# Altium schematic sheet IO_v35.SchDoc: AMF CONTROLLER GC12
size A4; Date: NOV 2011; DrawnBy: SURAJ; Engineer: SURAJ K A; Revision: 310; SheetNumber: 2; SheetTotal: 2
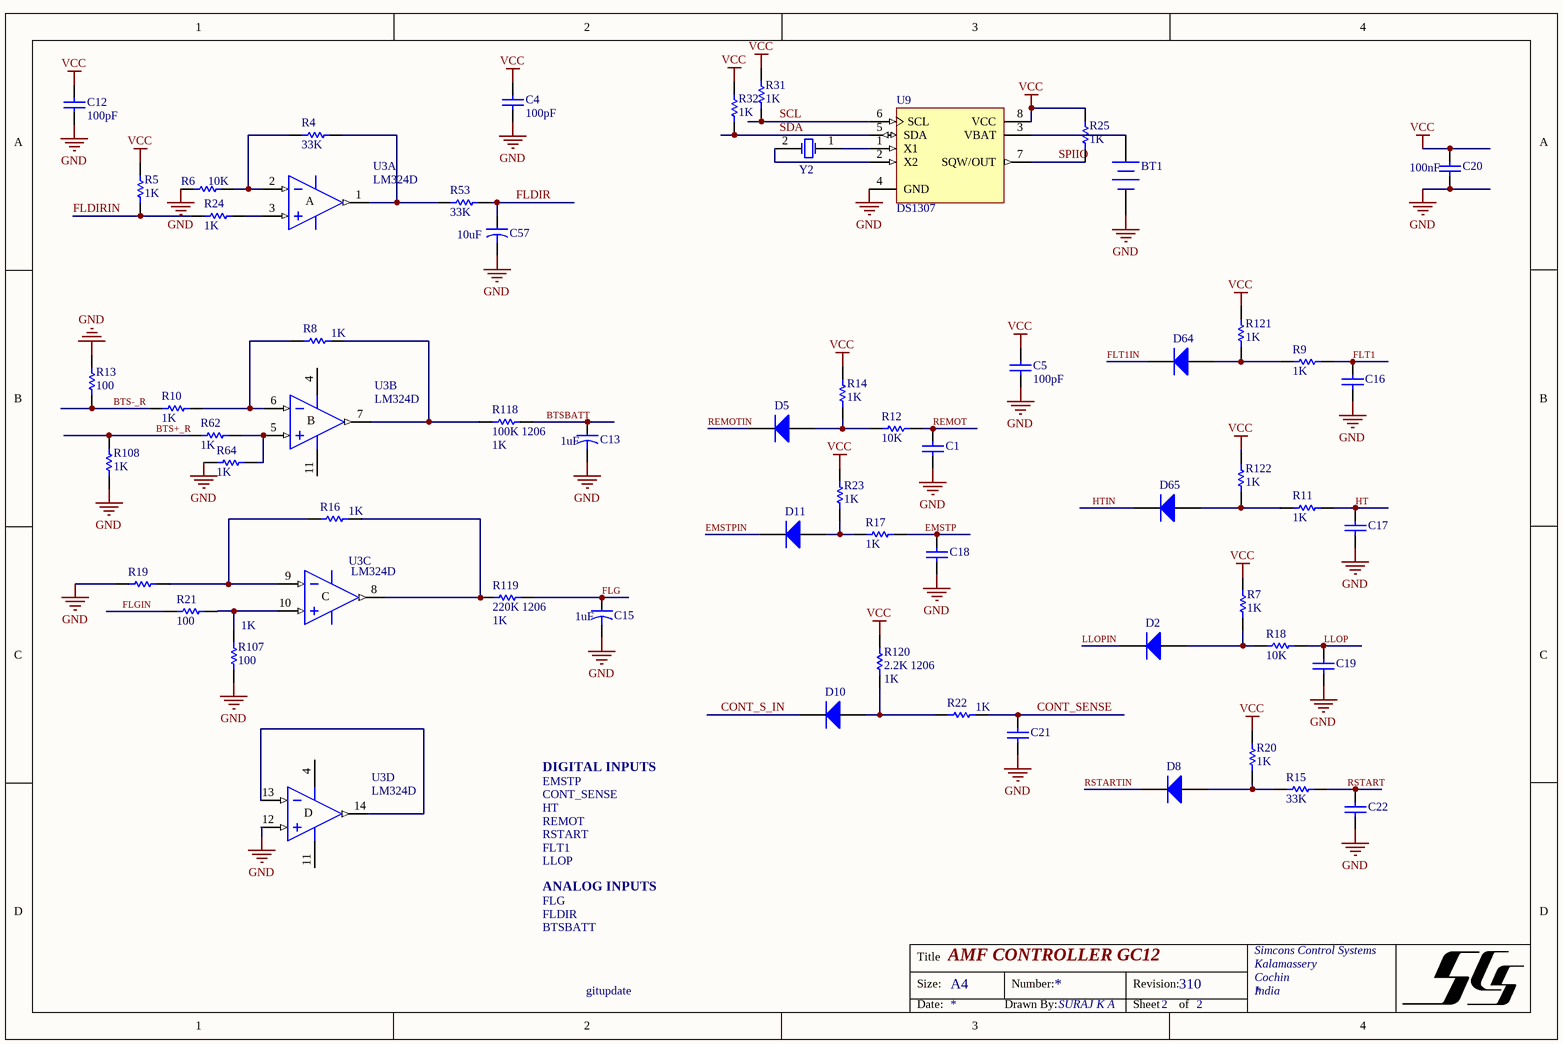
[diagram p0: IO_v35.SchDoc]

## Parts
BT1  CR2032  [CELL_HOLDER]  (value not drawn)
C1  .1uF 1206  [C1206]  (value not drawn)
C4  value 100pF  [C1206]  (hidden comment: .1uF 1206)
C5  value 100pF  [C1206]  (hidden comment: .1uF 1206)
C12  value 100pF  [C1206]  (hidden comment: .1uF 1206)
C13  value 1uF  [C1206]  (hidden comment: 1uF 1206)
C15  value 1uF  [C1206]  (hidden comment: 1uF 1206)
C16  .1uF 1206  [C1206]  (value not drawn)
C17  .1uF 1206  [C1206]  (value not drawn)
C18  .1uF 1206  [C1206]  (value not drawn)
C19  .1uF 1206  [C1206]  (value not drawn)
C20  value 100nF  [C1206]  (hidden comment: .1uF 1206)
C21  .1uF 1206  [C1206]  (value not drawn)
C22  .1uF 1206  [C1206]  (value not drawn)
C57  value 10uF  [C1206]  (hidden comment: 1uF 1206)
D2  1N4148 SMD  [4148SMDW]  (value not drawn)
D5  1N4148 SMD  [4148SMDW]  (value not drawn)
D8  1N4148 SMD  [4148SMDW]  (value not drawn)
D10  1N4148 SMD  [4148SMDW]  (value not drawn)
D11  1N4148 SMD  [4148SMDW]  (value not drawn)
D64  1N4148 SMD  [4148SMDW]  (value not drawn)
D65  1N4148 SMD  [4148SMDW]  (value not drawn)
R4  value 33K  [R1206]  (hidden comment: 220K 1206)
R5  value 1K  [R1206]  (hidden comment: 1K 1206)
R6  value 10K  [R1206]  (hidden comment: 100K 1206)
R7  value 1K  [R1206]  (hidden comment: 2.2K 1206)
R8  value 1K  [R1206]  (hidden comment: 1M 1206)
R9  value 1K  [R1206]  (hidden comment: 100K 1206)
R10  value 1K  [R1206]  (hidden comment: 1M 1206)
R11  value 1K  [R1206]  (hidden comment: 100K 1206)
R12  value 10K  [R1206]  (hidden comment: 100K 1206)
R13  value 100  [R1206]  (hidden comment: 47K 1206)
R14  value 1K  [R1206]  (hidden comment: 2.2K 1206)
R15  value 33K  [R1206]  (hidden comment: 100K 1206)
R16  value 1K  [R1206]  (hidden comment: 220K 1206)
R17  value 1K  [R1206]  (hidden comment: 100K 1206)
R18  value 10K  [R1206]  (hidden comment: 100K 1206)
R19  value 1K  [R1206]  (hidden comment: 220K 1206)
R20  value 1K  [R1206]  (hidden comment: 2.2K 1206)
R21  value 100  [R1206]  (hidden comment: 100K 1206)
R22  value 1K  [R1206]  (hidden comment: 100K 1206)
R23  value 1K  [R1206]  (hidden comment: 2.2K 1206)
R24  value 1K  [R1206]  (hidden comment: 100K 1206)
R25  value 1K  [R1206]  (hidden comment: 100K 1206)
R31  value 1K  [R1206]  (hidden comment: 4.7K 1206)
R32  value 1K  [R1206]  (hidden comment: 4.7K 1206)
R53  value 33K  [R1206]  (hidden comment: 220K 1206)
R62  value 1K  [R1206]  (hidden comment: 1M 1206)
R64  value 1K  [R1206]  (hidden comment: 1M 1206)
R107  value 100  [R1206]  (hidden comment: 220K 1206)
R108  value 1K  [R1206]  (hidden comment: 47K 1206)
R118  100K 1206  value 1K  [R1206]
R119  220K 1206  value 1K  [R1206]
R120  2.2K 1206  value 1K  [R1206]
R121  value 1K  [R1206]  (hidden comment: 2.2K 1206)
R122  value 1K  [R1206]  (hidden comment: 2.2K 1206)
U3  LM324D  [SOIC14_M]  (parts A,B,C,D of 4)
U9  DS1307  [DIP-8]
Y2  XTAL 32.768KHz 6pF  [XTALWATCH]  (value not drawn)

## Nets
GND: BT1.2(-) C1.1 C4.1 C5.1 C12.1 C13.2 C15.2 C16.1 C17.1 C18.1 C19.1 C20.1 C21.1 C22.1 C57.2 R6.2 R13.1 R19.1 R64.1 R107.2 R108.1 U3.11(V-) U3.12(IN+) U9.4(GND)
VCC: C4.2 C5.2 C12.2 C20.2 R5.1 R7.1 R14.1 R20.1 R23.1 R25.1 R31.1 R32.1 R120.2 R121.2 R122.2 U3.4(V+) U9.8(VCC)
BTS+_R: R62.1 R108.2
BTS-_R: R10.1 R13.2
BTSBATT: C13.1 R118.2
CONT_S_IN: D10.2(K)
CONT_SENSE: C21.2 R22.2
EMSTP: C18.2 R17.2
EMSTPIN: D11.2(K)
FLDIR: C57.1 R53.1
FLDIRIN: R5.2 R24.1
FLG: C15.1 R119.2
FLGIN: R21.2
FLT1: C16.2 R9.2
FLT1IN: D64.2(K)
HT: C17.2 R11.2
HTIN: D65.2(K)
LLOP: C19.2 R18.2
LLOPIN: D2.2(K)
REMOT: C1.2 R12.2
REMOTIN: D5.2(K)
RSTART: C22.2 R15.2
RSTARTIN: D8.2(K)
SCL: R31.2 U9.6(SCL)
SDA: R32.2 U9.5(SDA)
SPIIO: R25.2 U9.7(SQW/OUT)
NetBT1_1: BT1.1(+) U9.3(VBAT)
NetD2_1: D2.1(A) R7.2 R18.1
NetD5_1: D5.1(A) R12.1 R14.2
NetD8_1: D8.1(A) R15.1 R20.2
NetD10_1: D10.1(A) R22.1 R120.1
NetD11_1: D11.1(A) R17.1 R23.2
NetD64_1: D64.1(A) R9.1 R121.1
NetD65_1: D65.1(A) R11.1 R122.1
NetR4_1: R4.1 R53.2 U3.1(OUT)
NetR4_2: R4.2 R6.1 U3.2(IN-)
NetR8_1: R8.1 R10.2 U3.6(IN-)
NetR8_2: R8.2 R118.1 U3.7(OUT)
NetR16_1: R16.1 R19.2 U3.9(IN-)
NetR16_2: R16.2 R119.1 U3.8(OUT)
NetR21_1: R21.1 R107.1 U3.10(IN+)
NetR24_2: R24.2 U3.3(IN+)
NetR62_2: R62.2 R64.2 U3.5(IN+)
NetU3_13: U3.13(IN-) U3.14(OUT)
NetU9_1: U9.1(X1) Y2.1(OSC1)
NetU9_2: U9.2(X2) Y2.2(OSC2)

## Notes on the sheet
- DIGITAL INPUTS
- EMSTP
- CONT_SENSE
- HT
- REMOT
- RSTART
- FLT1
- LLOP
- ANALOG INPUTS
- FLG
- FLDIR
- BTSBATT
- gitupdate
- Title
- Size:
- A4
- Number:
- Revision:
- Simcons Control Systems
- Kalamassery
- Cochin
- India
- Date:
- Drawn By:
- SURAJ K A
- Sheet
- of
- (in symbol LM324D, part A) A
- (in symbol LM324D, part B) B
- (in symbol LM324D, part C) C
- (in symbol LM324D, part D) D

## Library data of the parts
BT1 = Battery: Multicell Battery; Published: 24-Mar-1999; LatestRevisionDate: 17-Jul-2002; LatestRevisionNote: Re-released for DXP Platform.; PackageReference: BAT-2; Publisher: Altium Limited; PackageDescription: Battery; 2 Leads
C1 C16-C19 C21 C22 = Cap: Capacitor; Value: 100pF; Published: 8-Jun-2000; LatestRevisionDate: 17-Jul-2002; LatestRevisionNote: Re-released for DXP Platform.; PackageReference: RAD-0.3; Publisher: Altium Limited; PackageDescription: Radial Cap, Thru-Hole; 2 Leads; 0.3 in Pin Spacing
C4 C5 C12 C20 = Cap: Capacitor; Published: 8-Jun-2000; LatestRevisionDate: 17-Jul-2002; LatestRevisionNote: Re-released for DXP Platform.; PackageReference: RAD-0.3; Publisher: Altium Limited; PackageDescription: Radial Cap, Thru-Hole; 2 Leads; 0.3 in Pin Spacing
C13 C15 C57 = Cap2: Capacitor; Published: 23-Sep-2002; PackageReference: CAPR5-4X5; Publisher: Altium Limited; PackageDescription: Capacitor; 2 Leads
D2 D5 D8 D10 D11 D64 D65 = Diode 1N4001: 1 Amp General Purpose Rectifier; Published: 8-Jun-2000; LatestRevisionDate: 17-Jul-2002; LatestRevisionNote: Re-released for DXP Platform.; DatasheetVersion: 1998; PackageVersion: Aug-1999; PackageReference: DO-41; Publisher: Altium Limited; PackageDescription: Diode, Axial; Body 5.2 x 2.7 mm (LxDia. max), Lead Dia. 0.86 mm (max); Code_JEDEC: DO-204-AL; ComponentLink1Description: Manufacturer Link; ComponentLink1URL: http://www.fairchildsemi.com/; ComponentLink2Description: Datasheet; ComponentLink2URL: http://www.fairchildsemi.com/ds/1N%2F1N4001.pdf
R4-R25 R31 R32 R53 R62 R64 R107 R108 = Res1: Resistor; Published: 8-Jun-2000; LatestRevisionDate: 17-Jul-2002; LatestRevisionNote: Re-released for DXP Platform.; PackageReference: AXIAL-0.3; Publisher: Altium Limited; PackageDescription: Axial Device, Thru-Hole; 2 Leads; 0.3 in Pin Spacing
R118-R122 = Res Semi: Semiconductor Resistor; Published: 8-Jun-2000; LatestRevisionDate: 17-Jul-2002; LatestRevisionNote: Re-released for DXP Platform.; PackageReference: AXIAL-0.5; Publisher: Altium Limited; PackageDescription: Axial Device, Thru-Hole; 2 Leads; 0.5 in Pin Spacing
U3 = LM324D: Quadruple Operational Amplifier; Published: 16-Jan-2001; LatestRevisionDate: 13-Apr-2006; LatestRevisionNote: IPC-7351 Footprint Added.; DatasheetVersion: Feb-1997; PackageVersion: Jan-1998; PackageReference: D014; Publisher: Altium Limited; PackageDescription: 14-Pin Small Outline Integrated Circuit 1.27 mm Pitch; Code_IPC: SOIC127P600-14; ComponentLink1Description: Manufacturer Link; ComponentLink1URL: http://www.ti.com/; ComponentLink2Description: Datasheet; ComponentLink2URL: http://www-s.ti.com/sc/ds/lm324.pdf
U9 = DS1307: 64 X 8 Serial Real-Time Clock; Published: 13-Oct-2000; LatestRevisionDate: 17-Jul-2002; LatestRevisionNote: Re-released for DXP Platform.; DatasheetVersion: 10-Aug-1999; PackageVersion: 1999; PackageReference: DIP8; Publisher: Altium Limited; PackageDescription: DIP, 8-Pin, Row Spacing 7.62 mm, Pitch 2.54 mm; ComponentLink1Description: Manufacturer Link; ComponentLink1URL: http://www.maxim-ic.com/; ComponentLink2Description: Datasheet; ComponentLink2URL: http://pdfserv.maxim-ic.com/en/ds/DS1307.pdf; ComponentLink3Description: Discontinuation Notice; ComponentLink3URL: http://www.maxim-ic.com/qa/pdfs/non-obsolescence-letter.pdf
Y2 = XTAL: Crystal Oscillator; Published: 8-Jun-2000; LatestRevisionDate: 17-Jul-2002; LatestRevisionNote: Re-released for DXP Platform.; PackageReference: R38; Publisher: Altium Limited; PackageDescription: Crystal, Thru-Hole; 2 Leads; Body 3.1 x 8.2 mm (Dia.xH)